# EAGLE design card-xmas-09 (EAGLE 5.06)
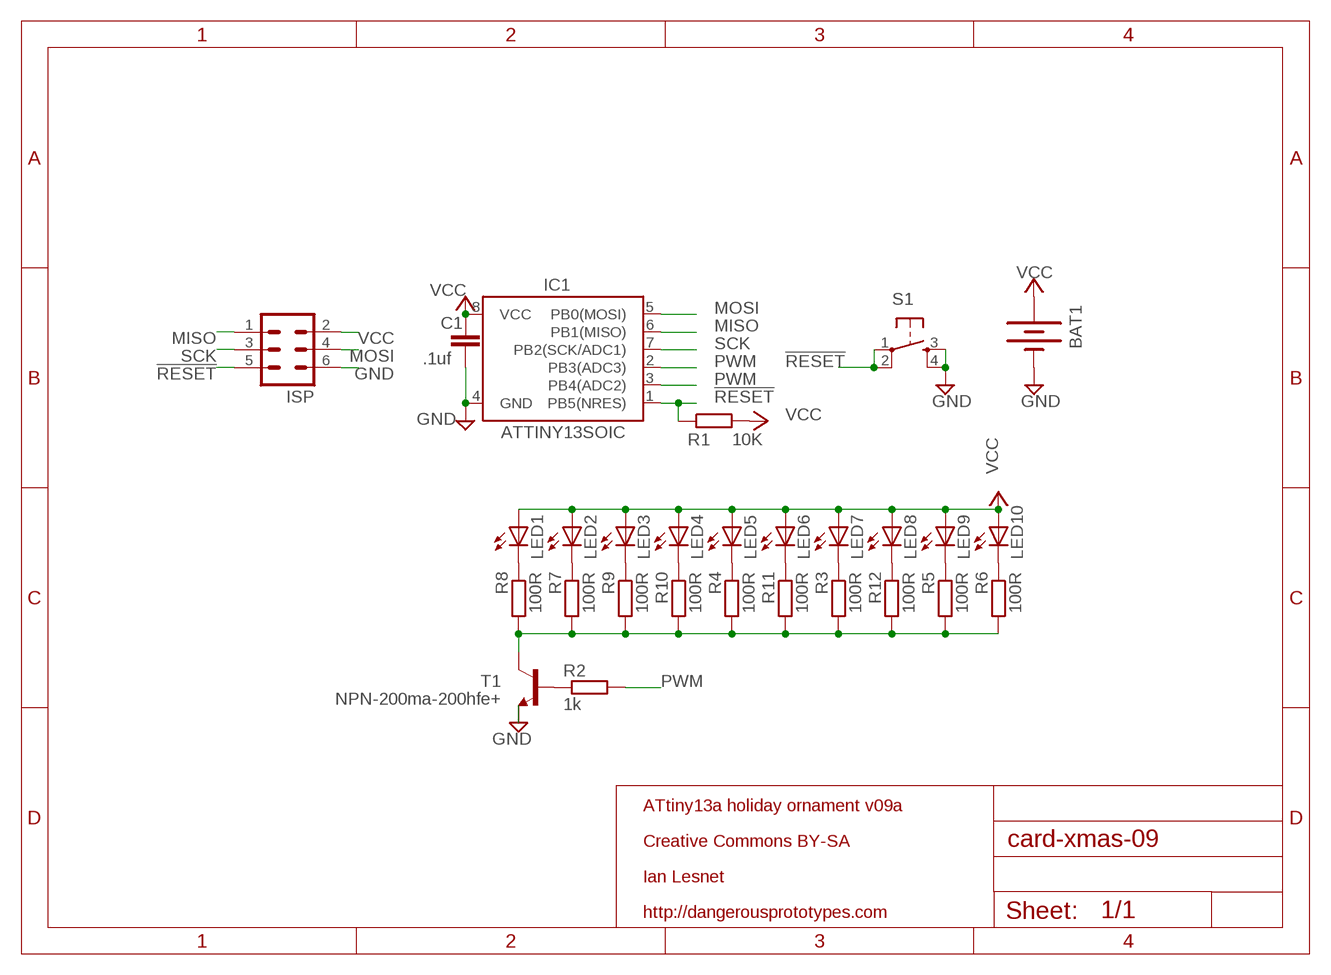
[diagram p0: schematic, sheet 1]

## Parts
BAT1  BATTERY20SMD  [BATTCON_20MM]
C1  .1uf  C-EUC0805  [C0805]
IC1  ATTINY13SOIC  [SO08]
ISP  MA03-2  [MA03-2]
LED1  LEDCHIPLED_0805  [CHIPLED_0805]
LED2  LEDCHIPLED_0805  [CHIPLED_0805]
LED3  LEDCHIPLED_0805  [CHIPLED_0805]
LED4  LEDCHIPLED_0805  [CHIPLED_0805]
LED5  LEDCHIPLED_0805  [CHIPLED_0805]
LED6  LEDCHIPLED_0805  [CHIPLED_0805]
LED7  LEDCHIPLED_0805  [CHIPLED_0805]
LED8  LEDCHIPLED_0805  [CHIPLED_0805]
LED9  LEDCHIPLED_0805  [CHIPLED_0805]
LED10  LEDCHIPLED_0805  [CHIPLED_0805]
R1  10k  R-EU_M0805  [M0805]
R2  1k  R-EU_M0805  [M0805]
R3  100R  R-EU_M0805  [M0805]
R4  100R  R-EU_M0805  [M0805]
R5  100R  R-EU_M0805  [M0805]
R6  100R  R-EU_M0805  [M0805]
R7  100R  R-EU_M0805  [M0805]
R8  100R  R-EU_M0805  [M0805]
R9  100R  R-EU_M0805  [M0805]
R10  100R  R-EU_M0805  [M0805]
R11  100R  R-EU_M0805  [M0805]
R12  100R  R-EU_M0805  [M0805]
S1  TAC_SWITCHSMD  [TACTILE_SWITCH_SMD]
T1  NPN-200ma-200hfe+  BCX70SMD  [SOT23]

## Nets
!RESET: IC1.1(PB5(NRES)) ISP.5 R1.1 S1.1 S1.2
GND: BAT1.2(-) C1.2 IC1.4(GND) ISP.6 S1.3 S1.4 T1.2(E)
MISO: IC1.6(PB1(MISO)) ISP.1
MOSI: IC1.5(PB0(MOSI)) ISP.4
N$4: R2.1 T1.1(B)
N$26: LED5.C R4.1
N$29: LED4.C R10.1
N$33: LED3.C R9.1
N$34: LED2.C R7.1
N$37: LED1.C R8.1
N$43: LED10.C R6.1
N$44: LED9.C R5.1
N$45: LED8.C R12.1
N$46: LED7.C R3.1
N$47: R3.2 R4.2 R5.2 R6.2 R7.2 R8.2 R9.2 R10.2 R11.2 R12.2 T1.3(C)
N$48: LED6.C R11.1
PWM: IC1.2(PB3(ADC3)) IC1.3(PB4(ADC2)) R2.2
SCK: IC1.7(PB2(SCK/ADC1)) ISP.3
VCC: BAT1.1(+) C1.1 IC1.8(VCC) ISP.2 LED1.A LED2.A LED3.A LED4.A LED5.A LED6.A LED7.A LED8.A LED9.A LED10.A R1.2

## Notes on the sheet
- 10K
- ATtiny13a holiday ornament v09a
- Creative Commons BY-SA
- Ian Lesnet
- http://dangerousprototypes.com

## Library data of the parts
BAT1 = SparkFun:BATTERY: Battery Holders Various common sizes : AA, AAA, 20mm coin cell and 12mm coin cell.
C1 = rcl:C-EU: CAPACITOR, European symbol
IC1 = SparkFun:ATTINY13
ISP = con-lstb:MA03-2: PIN HEADER
LED1-LED10 = led:LED: LED OSRAM: - CHIPLED LG R971, LG N971, LY N971, LG Q971, LY Q971, LO R971, LY R971 LH N974, LH R974 LS Q976, LO Q976, LY Q976 LO Q996 - Hyper CHIPLED LW Q18S LB Q993, LB Q99A, LB R99A - SideLED LS A670, LO A670, LY A670, LG A670, LP A670 LB A673, LV A673, LT A673, LW A673 LH A674 LY A675 LS A676, LA A676, LO A676, LY A676, LW A676 LS A679, LY A679, LG A679 - Hyper Micro SIDELED® LS Y876, LA Y876, LO Y876, LY Y876 LT Y87S - SmartLED LW L88C, LW L88S LB L89C, LB L89S, LG L890 LS L89K, LO L89K, LY L89K LS L896, LA L896, LO L896, LY L896 - TOPLED LS T670, LO T670, LY T670, LG T670, LP T670 LSG T670, LSP T670, LSY T670, LOP T670, LYG T670 LG T671, LOG T671, LSG T671 LB T673, LV T673, LT T673, LW T673 LH T674 LS T676, LA T676, LO T676, LY T676, LB T676, LH T676, LSB T676, LW T676 LB T67C, LV T67C, LT T67C, LS T67K, LO T67K, LY T67K, LW E67C LS E67B, LA E67B, LO E67B, LY E67B, LB E67C, LV E67C, LT E67C LW T67C LS T679, LY T679, LG T679 LS T770, LO T770, LY T770, LG T770, LP T770 LB T773, LV T773, LT T773, LW T773 LH T774 LS E675, LA E675, LY E675, LS T675 LS T776, LA T776, LO T776, LY T776, LB T776 LHGB T686 LT T68C, LB T68C - Hyper Mini TOPLED® LB M676 - Mini TOPLED Santana® LG M470 LS M47K, LO M47K, LY M47K Source: http://www.osram.convergy.de - LUMILED® LXK2-PW12-R00, LXK2-PW12-S00, LXK2-PW14-U00, LXK2-PW14-V00 LXK2-PM12-R00, LXK2-PM12-S00, LXK2-PM14-U00 LXK2-PE12-Q00, LXK2-PE12-R00, LXK2-PE12-S00, LXK2-PE14-T00, LXK2-PE14-U00 LXK2-PB12-K00, LXK2-PB12-L00, LXK2-PB12-M00, LXK2-PB14-N00, LXK2-PB14-P00, LXK2-PB14-Q00 LXK2-PR12-L00, LXK2-PR12-M00, LXK2-PR14-Q00, LXK2-PR14-R00 LXK2-PD12-Q00, LXK2-PD12-R00, LXK2-PD12-S00 LXK2-PH12-R00, LXK2-PH12-S00 LXK2-PL12-P00, LXK2-PL12-Q00, LXK2-PL12-R00 Source: www.luxeon.com
R1-R12 = rcl:R-EU_: RESISTOR, European symbol
S1 = SparkFun:TAC_SWITCH: Momentary Switch Button commonly used for reset or general input. Spark Fun Electronics SKU : COM-00097
T1 = transistor:BCX70SMD: NPN TRANSISTOR

## Board
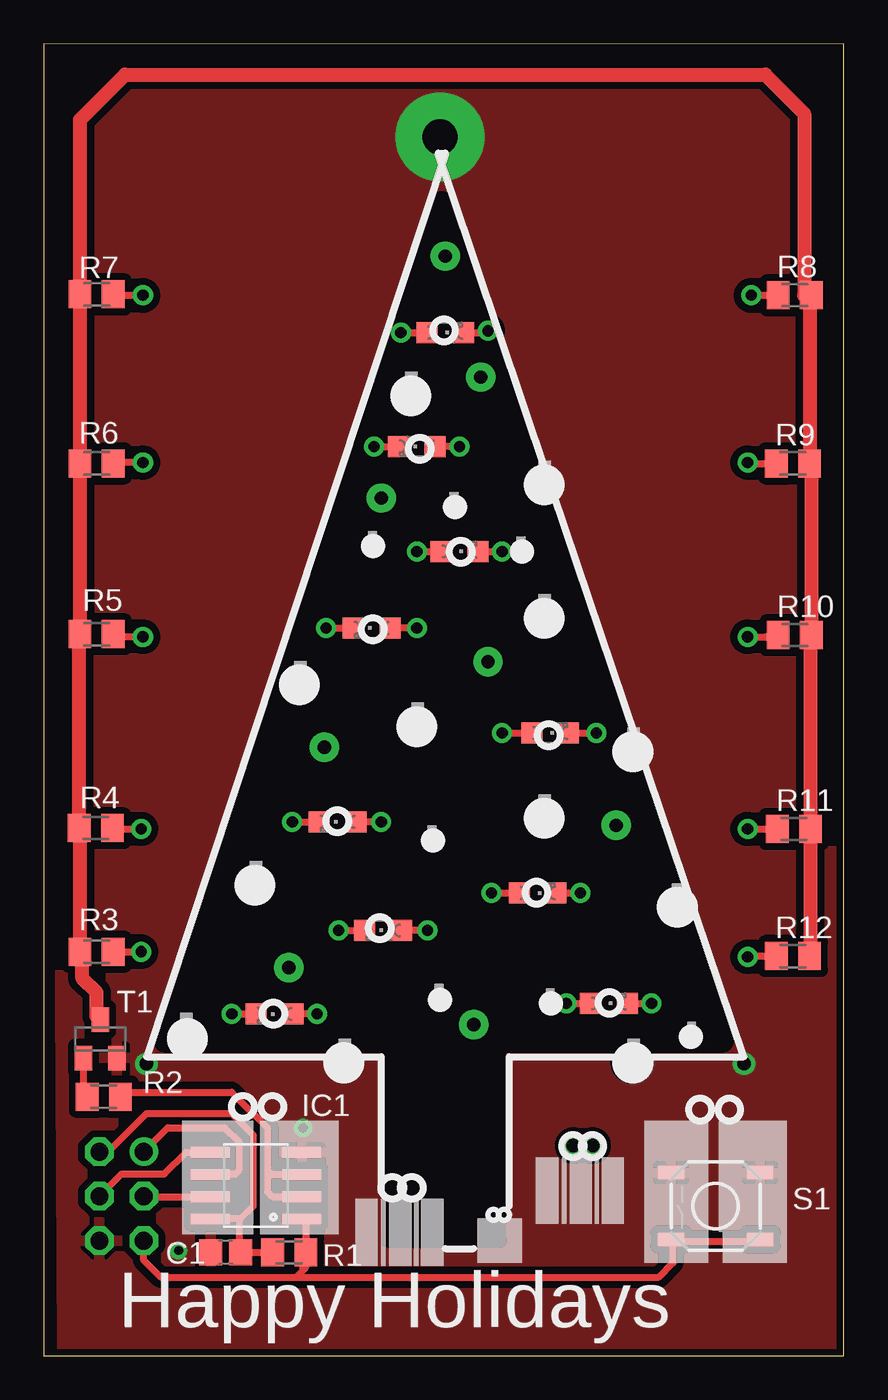
[diagram p1: board, top side]
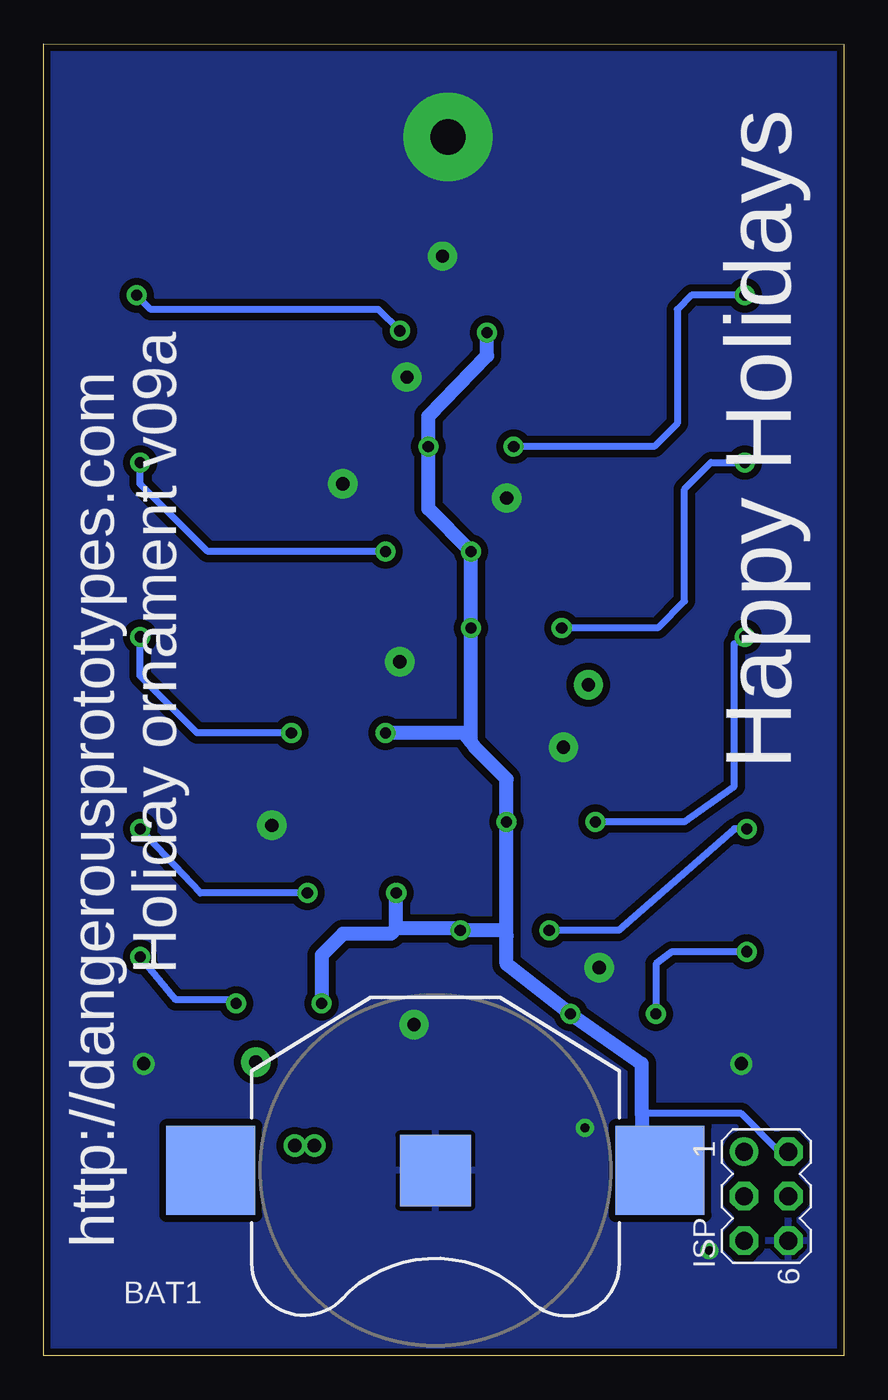
[diagram p2: board, bottom side, seen from below]

Size 45.72 x 74.93 mm. Coordinates in mm from the lower left corner, seen from the top.
Outline: 0,74.89 0.01,0 45.72,0 45.72,74.93 0,74.89
Copper layers (1*16): Top 0.035mm / dielectric 1.5mm / Bottom 0.035mm
Design rules "SparkFun": minimum track width 8mil, minimum drill 20mil, track to track 8mil, track to pad 8mil, pad to pad 8mil, via to via 8mil, smd to smd 8mil, copper to edge 10mil, drill to drill 8mil, minimum pad ring 12mil, minimum via ring 10mil, stop-mask expansion 4mil, vias tented up to drill 25mil, thermal gap 10mil
tRestrict: area 7,18 to 38.7,65.8; area 19.7,6.6 to 26,18

### Footprints (pad centres in the part's own frame; a part is rotated, then mirrored left to right if it is on the bottom)
BATTCON_20MM = smd 5.08 x 5.08: 1 -12.827,0; 3 12.827,0 | smd 4.064 x 4.064: 2 0,0
C0805 = smd 1.3 x 1.5: 1 -0.85,0; 2 0.85,0
SO08 = smd 0.61 x 2.21: 1 -1.905,-2.616; 2 -0.635,-2.616; 3 0.635,-2.616; 4 1.905,-2.616; 5 1.905,2.616; 6 0.635,2.616; 7 -0.635,2.616; 8 -1.905,2.616
MA03-2 = drill 1.016 round: 1 -2.54,-1.27 | drill 1.016 octagon: 2 -2.54,1.27; 3 0,-1.27; 4 0,1.27; 5 2.54,-1.27; 6 2.54,1.27
CHIPLED_0805 = smd 1.2 x 1.2: A 0,-1.05; C 0,1.05
M0805 = smd 1.3 x 1.6: 1 -0.95,0; 2 0.95,0
TACTILE_SWITCH_SMD = smd 1.524 x 0.762: 1 -2.54,1.905; 2 2.54,1.905; 3 -2.54,-1.905; 4 2.54,-1.905
SOT23 = smd 1 x 1.4: 1 -0.95,-1.1; 2 0.95,-1.1; 3 0,1.1

### Placement (x,y rotation side)
BAT1  23.34,10.58 180 bottom
C1  10.39,5.91 180 top
IC1  12.12,9.72 90 top
ISP  4.45,9.11 270 bottom
LED1  22.94,58.43 270 top
LED2  21.31,51.93 90 top
LED3  23.75,45.94 270 top
LED4  28.93,35.57 270 top
LED5  19.38,24.3 90 top
LED6  28.22,26.43 270 top
LED7  13.18,19.52 90 top
LED8  32.28,20.13 270 top
LED9  16.79,30.49 90 top
LED10  18.72,41.57 90 top
R1  14.02,5.91 180 top
R2  390R  [M0805]  3.43,14.8 0 top
R3  390R  [M0805]  3.02,23.08 180 top
R4  390R  [M0805]  2.97,30.14 180 top
R5  390R  [M0805]  3.02,41.21 180 top
R6  390R  [M0805]  3.02,50.97 180 top
R7  390R  [M0805]  3.02,60.62 180 top
R8  390R  [M0805]  42.9,60.57 0 top
R9  390R  [M0805]  42.8,50.97 0 top
R10  390R  [M0805]  42.9,41.16 0 top
R11  390R  [M0805]  42.85,30.09 0 top
R12  390R  [M0805]  42.8,22.82 0 top
S1  38.38,8.55 180 top
T1  3.23,18.1 0 top

### Tracks (layer width: path | path; a pad name or v marks a point on that pad's centre or on a via)
!RESET
  Top 0.406: 14.97,7.57 R1.1 14.81,5.74 14.81,4.89 14.4,4.48 | 14.97,7.57 IC1.1 | ISP.5 5.71,5.45 6.68,4.48 14.4,4.48 | 14.97,7.57 14.97,5.05 14.4,4.48 | 14.4,4.48 35.13,4.48 35.94,5.3 35.94,6.54 | 35.94,6.54 S1.2 | 35.94,6.54 40.82,6.54 S1.1
GND  (via drill 0.51, 0.76, 0.76 pad 1.68, 2 pad 5.08)
  other vias: 14.81,13.02 22.63,69.61 28.63,49.8 25.37,39.64 16.03,34.76 24.56,18.91 19.28,48.98 24.97,55.89 22.94,62.8 14,22.16 32.69,30.29 5.87,16.68 40.01,16.68 7.7,6.01
  pour Top (isolate 0.406): 45.09,75.45 45.09,0.47 1.04,0.47 0.64,75.04
  pour Bottom (isolate 0.406): 0.58,75.6 45.29,75.6 45.29,0.42 0.58,0.42
MISO
  Top 0.406: IC1.6 10.92,10.35 11.15,10.58 11.15,12.2 10.34,13.02 7.09,13.02 ISP.1
MOSI
  Top 0.406: IC1.5 8.13,11.62 6.88,10.38 4.45,10.38 ISP.4
N$1  (via drill 0.76 pad 1.68)
  other vias: 14.61,38.32
N$2  (via drill 0.76 pad 1.68)
  other vias: 33.6,16.78
N$4
  Top 0.406: T1.1 2.28,15 R2.1
N$5  (via drill 0.76 pad 1.27)
  other vias: 30.25,12
N$6  (via drill 0.76 pad 1.27)
  other vias: 31.37,12
N$26  (via drill 0.64)
  Top 0.406: v16.84,24.29 LED5.C | v5.56,30.09 4.18,30.09 R4.1
  Bottom 0.406: v16.84,24.29 12.88,24.29 6.27,30.09 v5.56,30.09
N$29  (via drill 0.64)
  Top 0.406: LED4.C v31.57,35.57 | v40.21,41.06 41.24,41.06 R10.1
  Bottom 0.406: v31.57,35.57 36.96,35.57 40.21,38.82 v40.21,41.06
N$33  (via drill 0.64)
  Top 0.406: R9.1 39.85,50.97 v40.21,51.02 | LED3.C v26.19,45.94
  Bottom 0.406: v40.21,51.02 40.21,49.8 36.35,45.94 v26.19,45.94
N$34  (via drill 0.64)
  Top 0.406: v18.87,51.93 LED2.C | v5.66,60.57 4.43,60.57 R7.1
  Bottom 0.406: v18.87,51.93 10.85,51.93 9.53,53.25 9.53,59.75 8.71,60.57 v5.66,60.57
N$37  (via drill 0.64)
  Top 0.406: v40.41,60.57 R8.1 | LED1.C 25.27,58.43 v25.38,58.53
  Bottom 0.406: v40.41,60.57 39.6,59.75 26.59,59.75 v25.38,58.53
N$43  (via drill 0.64)
  Top 0.406: v16.13,41.57 LED10.C | v5.66,51.02 4.43,51.02 R6.1
  Bottom 0.406: v16.13,41.57 10.64,41.57 9.12,43.09 9.12,49.49 7.6,51.02 v5.66,51.02
N$44  (via drill 0.64)
  Top 0.406: v14.2,30.49 LED9.C | v5.66,41.06 4.33,41.06 R5.1
  Bottom 0.406: v14.2,30.49 9.12,30.49 6.27,32.53 6.27,40.65 v5.66,41.06
N$45  (via drill 0.64)
  Top 0.406: LED8.C v34.72,20.13 | v40.21,22.77 40.51,22.84 R12.1
  Bottom 0.406: v34.72,20.13 34.72,20.33 38.18,20.33 v40.21,22.77
N$46  (via drill 0.64)
  Top 0.406: v10.74,19.52 LED7.C | R3.1 v5.56,23.08
  Bottom 0.406: v5.56,23.08 9.83,23.08 10.74,22.36 v10.74,19.52
N$47
  Top 0.406: T1.3 3.02,19.4
  Top 0.61: R6.2 2.38,50.97 | 43.44,60.57 R8.2
  Top 0.813: R12.2 43.8,22.87 R11.2 43.8,41.11 R10.2 43.85,50.86 R9.2 43.75,60.46 R8.2 | 43.44,60.57 43.44,70.94 41.22,73.16 4.65,73.16 2.07,70.59 R7.2 R6.2 R5.2 2.02,41.16 R4.2 2.07,30.09 R3.2 2.21,22.94 2.21,21.55 3.02,20.74 3.02,19.4
N$48  (via drill 0.64)
  Top 0.406: LED6.C v30.66,26.43 | v40.21,30.09 R11.1
  Bottom 0.406: v30.66,26.43 36.75,26.43 v40.21,30.09
PWM
  Top 0.406: IC1.2 13.06,9.08 12.78,9.36 12.78,10.58 | 12.78,10.58 12.78,13.02 10.74,15.05 4.63,15.05 R2.2 | IC1.3 13.01,10.35 12.78,10.58
SCK
  Top 0.406: IC1.7 5.74,9.08 ISP.3
VCC  (via drill 0.64)
  Top 0.406: 13.06,5.92 R1.2 11.76,5.91 11.56,6.11 | 11.15,7.81 IC1.8 9.53,7.78 | 11.15,7.81 11.23,7.81 11.96,8.55 11.96,12.61 10.74,13.83 5.87,13.83 3.83,11.8 3.33,11.8 ISP.2 | 11.56,6.11 11.15,6.51 11.15,7.81 | C1.1 11.56,5.91 11.56,6.11 | v15.62,19.52 LED7.A | v29.84,20.13 LED8.A | v19.28,30.49 LED9.A | v21.31,41.57 LED10.A | v26.19,35.57 LED4.A | v21.31,45.94 LED3.A | v23.75,51.93 LED2.A | v20.4,58.43 LED1.A | v25.58,26.43 LED6.A | v21.92,24.29 LED5.A
  Bottom 0.406: v21.31,41.57 21.31,41.77 | 19.28,23.99 19.58,24.29 | v21.92,24.29 21.82,24.4 | ISP.2 3.33,11.8 3.83,11.8 5.87,13.83 11.56,13.83
  Bottom 0.813: 21.31,35.07 21.11,34.76 19.28,32.93 v19.28,30.49 19.28,23.99 19.28,22.36 v15.62,19.52 11.56,16.68 11.56,13.83 11.56,12.2 11.96,11.8 11.73,11.8 BAT1.1 | 21.31,35.07 v21.31,41.57 | v26.19,35.57 21.72,35.57 21.31,35.07 | 21.31,41.77 v21.31,45.94 23.75,48.37 v23.75,51.93 23.75,53.66 20.4,57.11 v20.4,58.43 | v29.84,20.13 29.84,22.87 28.63,24.09 25.88,24.09 25.58,24.4 | 25.58,24.4 v25.58,26.43 | 19.58,24.29 v21.92,24.29 | 21.82,24.4 25.58,24.4

### Text on the board
tNames: Happy Holidays
bNames: Happy Holidays | Holiday ornament v09a | http://dangerousprototypes.com